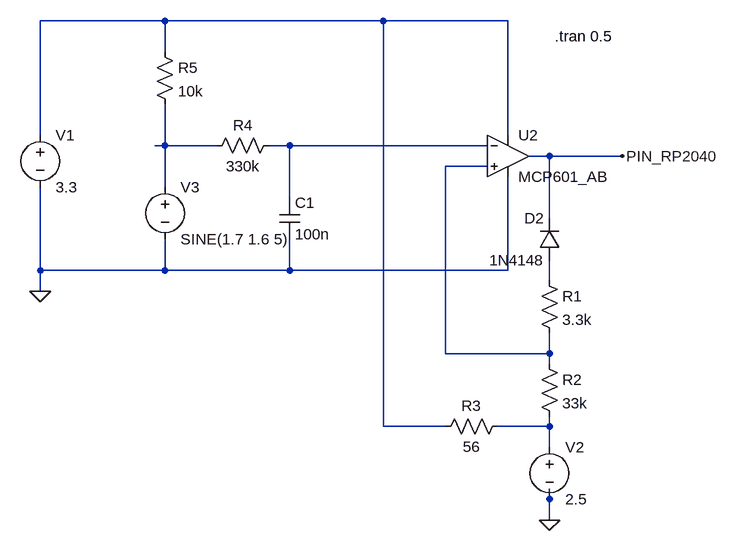
[diagram p0: schematic Trigger.asc]
Trigger.asc, the LTspice schematic file:
Version 4
SHEET 1 880 692
WIRE -368 -96 -560 -96
WIRE -32 -96 -368 -96
WIRE 160 -96 -32 -96
WIRE -368 -48 -368 -96
WIRE -560 80 -560 -96
WIRE 160 80 160 -96
WIRE -368 96 -368 32
WIRE -368 96 -384 96
WIRE -288 96 -368 96
WIRE -176 96 -208 96
WIRE 128 96 -176 96
WIRE 224 112 192 112
WIRE 336 112 224 112
WIRE 128 128 64 128
WIRE -368 160 -368 96
WIRE -176 176 -176 96
WIRE 224 208 224 112
WIRE -560 288 -560 160
WIRE -368 288 -368 240
WIRE -368 288 -560 288
WIRE -176 288 -176 240
WIRE -176 288 -368 288
WIRE 160 288 160 144
WIRE 160 288 -176 288
WIRE 224 304 224 272
WIRE -560 320 -560 288
WIRE 64 416 64 128
WIRE 224 416 224 384
WIRE 224 416 64 416
WIRE 224 432 224 416
WIRE -32 528 -32 -96
WIRE 64 528 -32 528
WIRE 224 528 224 512
WIRE 224 528 144 528
WIRE 224 560 224 528
WIRE 224 640 224 624
WIRE 224 672 224 640
FLAG -560 320 0
FLAG 224 672 0
FLAG 336 112 PIN_RP2040
SYMBOL voltage -560 64 R0
WINDOW 123 0 0 Left 0
WINDOW 39 0 0 Left 0
SYMATTR InstName V1
SYMATTR Value 3.3
SYMBOL res 208 288 R0
SYMATTR InstName R1
SYMATTR Value 3.3k
SYMBOL res 208 416 R0
SYMATTR InstName R2
SYMATTR Value 33k
SYMBOL res 160 512 R90
WINDOW 0 0 56 VBottom 2
WINDOW 3 32 56 VTop 2
SYMATTR InstName R3
SYMATTR Value 56
SYMBOL diode 240 272 R180
WINDOW 0 24 64 Left 2
WINDOW 3 24 0 Left 2
SYMATTR InstName D2
SYMATTR Value 1N4148
SYMBOL cap -192 176 R0
SYMATTR InstName C1
SYMATTR Value 100n
SYMBOL res -192 80 R90
WINDOW 0 0 56 VBottom 2
WINDOW 3 32 56 VTop 2
SYMATTR InstName R4
SYMATTR Value 330k
SYMBOL res -384 -64 R0
SYMATTR InstName R5
SYMATTR Value 10k
SYMBOL voltage 224 544 R0
WINDOW 123 0 0 Left 0
WINDOW 39 0 0 Left 0
SYMATTR InstName V2
SYMATTR Value 2.5
SYMBOL ZZZ\\OpAmp\\MCP601_AB 160 48 R0
SYMATTR InstName U2
SYMBOL voltage -368 144 R0
WINDOW 123 0 0 Left 0
WINDOW 39 0 0 Left 0
SYMATTR InstName V3
SYMATTR Value SINE(1.7 1.6 5)
TEXT 232 -72 Left 2 !.tran 0.5

The netlist it stands for:
* Trigger.asc
V1 N001 0 3.3
R1 N005 N004 3.3k
R2 N004 N006 33k
R3 N006 N001 56
D2 N005 PIN_RP2040 1N4148
C1 N003 0 100n
R4 N003 N002 330k
R5 N001 N002 10k
V2 N006 0 2.5
* U2: MCP601_AB (symbol ZZZ\OpAmp\MCP601_AB not available, pins judged from their places): In+=N004 In-=N003 V+=N001 V-=0 OUT=PIN_RP2040
V3 N002 0 SINE(1.7 1.6 5)
.model D D
.lib standard.dio
.tran 0.5
.backanno
.end